# EAGLE design IS31SE5117-Breakout (EAGLE 9.6.2)
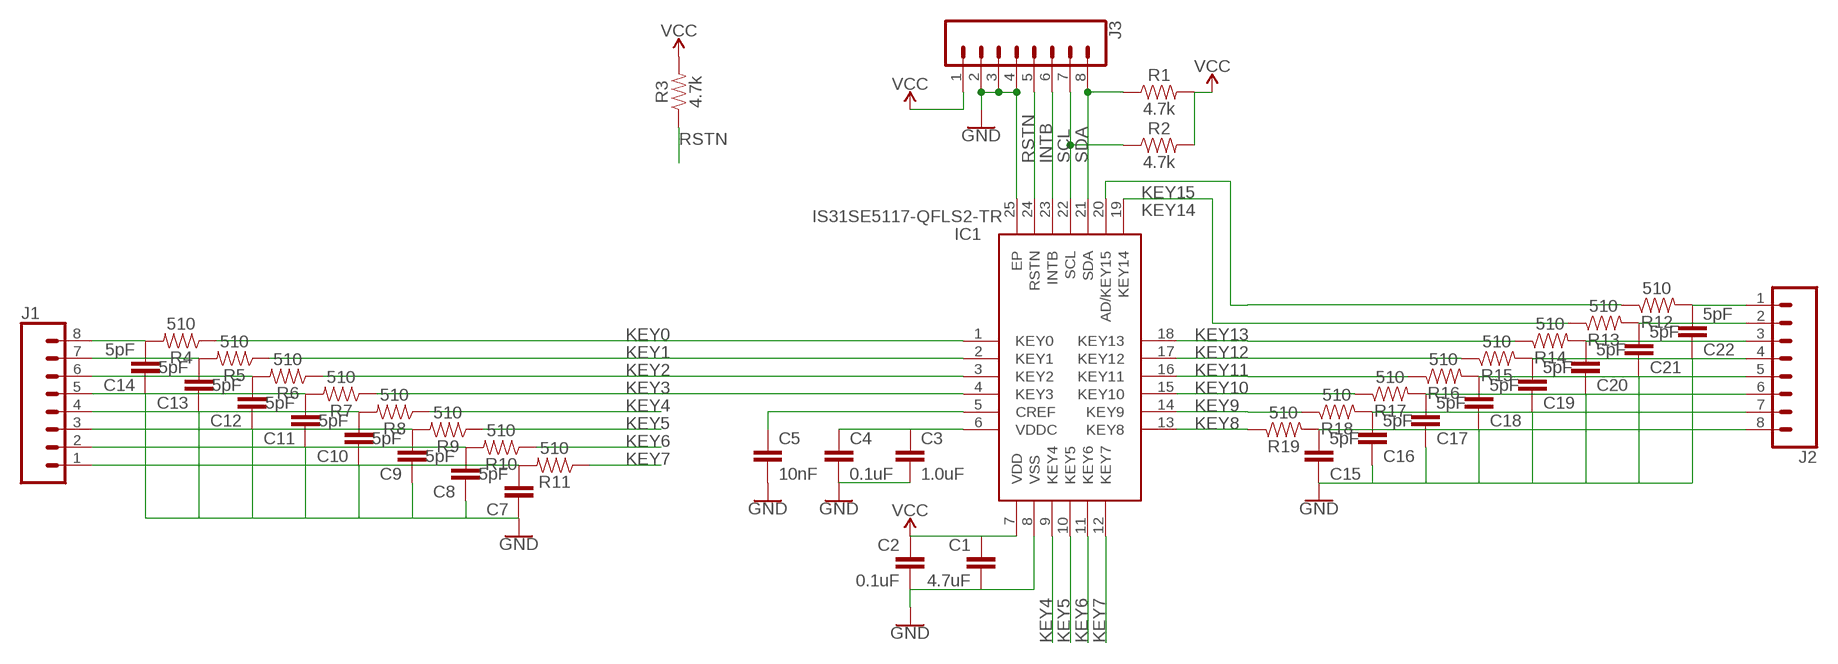
[diagram p0: schematic, sheet 1]

## Parts
C1  4.7uF  1.0UF-0603-16V-10%-X7R  [0603]
C2  0.1uF  0.1UF-0603-25V-10%-X7R-WE  [0603]
C3  1.0uF  1.0UF-0603-16V-10%-X7R  [0603]
C4  0.1uF  0.1UF-0603-25V-10%-X7R-WE  [0603]
C5  10nF  10NF-0603-50V-10%  [0603]
C7  5pF  10NF-0603-50V-10%  [0603]
C8  5pF  10NF-0603-50V-10%  [0603]
C9  5pF  10NF-0603-50V-10%  [0603]
C10  5pF  10NF-0603-50V-10%  [0603]
C11  5pF  10NF-0603-50V-10%  [0603]
C12  5pF  10NF-0603-50V-10%  [0603]
C13  5pF  10NF-0603-50V-10%  [0603]
C14  5pF  10NF-0603-50V-10%  [0603]
C15  5pF  10NF-0603-50V-10%  [0603]
C16  5pF  10NF-0603-50V-10%  [0603]
C17  5pF  10NF-0603-50V-10%  [0603]
C18  5pF  10NF-0603-50V-10%  [0603]
C19  5pF  10NF-0603-50V-10%  [0603]
C20  5pF  10NF-0603-50V-10%  [0603]
C21  5pF  10NF-0603-50V-10%  [0603]
C22  5pF  10NF-0603-50V-10%  [0603]
IC1  IS31SE5117-QFLS2-TR  [QFN50P400X400X65-25N]
J1  CONN_08LONGPADS  [1X08_LONGPADS]
J2  CONN_08LONGPADS  [1X08_LONGPADS]
J3  CONN_08LONGPADS  [1X08_LONGPADS]
R1  4.7k  4.7KOHM-0603-1/10W-1%  [0603]
R2  4.7k  4.7KOHM-0603-1/10W-1%  [0603]
R3  4.7k  4.7KOHM-0603-1/10W-1%  [0603]
R4  510  4.7KOHM-0603-1/10W-1%  [0603]
R5  510  4.7KOHM-0603-1/10W-1%  [0603]
R6  510  4.7KOHM-0603-1/10W-1%  [0603]
R7  510  4.7KOHM-0603-1/10W-1%  [0603]
R8  510  4.7KOHM-0603-1/10W-1%  [0603]
R9  510  4.7KOHM-0603-1/10W-1%  [0603]
R10  510  4.7KOHM-0603-1/10W-1%  [0603]
R11  510  4.7KOHM-0603-1/10W-1%  [0603]
R12  510  4.7KOHM-0603-1/10W-1%  [0603]
R13  510  4.7KOHM-0603-1/10W-1%  [0603]
R14  510  4.7KOHM-0603-1/10W-1%  [0603]
R15  510  4.7KOHM-0603-1/10W-1%  [0603]
R16  510  4.7KOHM-0603-1/10W-1%  [0603]
R17  510  4.7KOHM-0603-1/10W-1%  [0603]
R18  510  4.7KOHM-0603-1/10W-1%  [0603]
R19  510  4.7KOHM-0603-1/10W-1%  [0603]

## Nets
GND: C1.2 C2.2 C3.2 C4.2 C5.2 C7.1 C8.1 C9.1 C10.1 C11.1 C12.1 C13.1 C14.1 C15.1 C16.1 C17.1 C18.1 C19.1 C20.1 C21.1 C22.1 IC1.8(VSS) IC1.25(EP) J3.2 J3.3 J3.4
INTB: IC1.23(INTB) J3.6
KEY0: IC1.1(KEY0) R4.1
KEY1: IC1.2(KEY1) R5.1
KEY2: IC1.3(KEY2) R6.1
KEY3: IC1.4(KEY3) R7.1
KEY4: IC1.9(KEY4) R8.1
KEY5: IC1.10(KEY5) R9.1
KEY6: IC1.11(KEY6) R10.1
KEY7: IC1.12(KEY7) R11.1
KEY8: IC1.13(KEY8) R19.1
KEY9: IC1.14(KEY9) R18.1
KEY10: IC1.15(KEY10) R17.1
KEY11: IC1.16(KEY11) R16.1
KEY12: IC1.17(KEY12) R15.1
KEY13: IC1.18(KEY13) R14.1
KEY14: IC1.19(KEY14) R13.1
KEY15: IC1.20(AD/KEY15) R12.1
N$1: C14.2 J1.8 R4.2
N$2: C13.2 J1.7 R5.2
N$3: C12.2 J1.6 R6.2
N$4: C11.2 J1.5 R7.2
N$5: C10.2 J1.4 R8.2
N$6: C9.2 J1.3 R9.2
N$7: C7.2 J1.1 R11.2
N$8: C8.2 J1.2 R10.2
N$9: C22.2 J2.1 R12.2
N$10: C21.2 J2.2 R13.2
N$11: C20.2 J2.3 R14.2
N$12: C19.2 J2.4 R15.2
N$13: C18.2 J2.5 R16.2
N$14: C3.1 C4.1 IC1.6(VDDC)
N$15: C5.1 IC1.5(CREF)
N$16: C17.2 J2.6 R17.2
N$17: C15.2 J2.8 R19.2
N$18: C16.2 J2.7 R18.2
RSTN: IC1.24(RSTN) J3.5 R3.1
SCL: IC1.22(SCL) J3.7 R2.1
SDA: IC1.21(SDA) J3.8 R1.1
VCC: C1.1 C2.1 IC1.7(VDD) J3.1 R1.2 R2.2 R3.2

## Library data of the parts
C1 = SparkFun-Capacitors:1.0UF: 1µF ceramic capacitors A capacitor is a passive two-terminal electrical component used to store electrical energy temporarily in an electric field.; PROD_ID: CAP-13930; VALUE: 1.0uF
C2 C4 = SparkFun-Capacitors:0.1UF: 0.1µF ceramic capacitors A capacitor is a passive two-terminal electrical component used to store electrical energy temporarily in an electric field.; PROD_ID: CAP-16503
C3 = SparkFun-Capacitors:1.0UF: 1µF ceramic capacitors A capacitor is a passive two-terminal electrical component used to store electrical energy temporarily in an electric field.; PROD_ID: CAP-13930
C5 = SparkFun-Capacitors:10NF: 0.01uF/10nF/10,000pF ceramic capacitors A capacitor is a passive two-terminal electrical component used to store electrical energy temporarily in an electric field. CAP-09321; PROD_ID: CAP-00867
C7-C22 = SparkFun-Capacitors:10NF: 0.01uF/10nF/10,000pF ceramic capacitors A capacitor is a passive two-terminal electrical component used to store electrical energy temporarily in an electric field. CAP-09321; PROD_ID: CAP-00867; VALUE: 10nF
IC1 = SamacSys_Parts:IS31SE5117-QFLS2-TR: Capacitive Touch Sensors MCU with 2KB SRAM and 32Kx16 ECC E-Flash, QFN-24, (4mm x 4mm), T&R Source: Datasheet <https://lumissil.com/assets/pdf/core/IS31SE5117_DS.pdf>; DESCRIPTION: Capacitive Touch Sensors MCU with 2KB SRAM and 32Kx16 ECC E-Flash, QFN-24, (4mm x 4mm), T&R; HEIGHT: 0.65mm; MANUFACTURER_NAME: Lumissil Microsystems; MANUFACTURER_PART_NUMBER: IS31SE5117-QFLS2-TR; MOUSER_PART_NUMBER: 870-IS31SE517QFLS2TR; MOUSER_PRICE-STOCK: https://www.mouser.co.uk/ProductDetail/Lumissil/IS31SE5117-QFLS2-TR/?qs=W%2FMpXkg%252BdQ6cSgyNgg%2FCzg%3D%3D
J1-J3 = SparkFun-Connectors:CONN_08: Multi connection point. Often used as Generic Header-pin footprint for 0.1 inch spaced/style header connections On any of the 0.1 inch spaced packages, you can populate with these: Break Away Headers - Straight <https://www.sparkfun.com/products/116> (PRT-00116) Break Away Male Headers - Right Angle <https://www.sparkfun.com/products/553> (PRT-00553) Female Headers <https://www.sparkfun.com/products/115> (PRT-00115) Break Away Headers - Machine Pin <https://www.sparkfun.com/products/117> (PRT-00117) Break Away Female Headers - Swiss Machine Pin <https://www.sparkfun.com/products/743> (PRT-00743) Arduino Stackable Header - 8 Pin <https://www.sparkfun.com/products/9279> (PRT-09279) For SCREWTERMINALS and SPRING TERMINALS visit here: Screw Terimnals on SparkFun.com <https://www.sparkfun.com/search/results?term=Screw+Terminals> (5mm/3.5mm/2.54mm spacing) This device is also useful as a general connection point to wire up your design to another part of your project. Our various solder wires solder well into these plated through hole pads. Hook-Up Wire - Assortment (Stranded, 22 AWG) <https://www.sparkfun.com/products/11375> (PRT-11375) Hook-Up Wire - Assortment (Solid Core, 22 AWG) <https://www.sparkfun.com/products/11367> (PRT-11367) View the entire wire category on our website here <https://www.sparkfun.com/categories/141> Special notes: Molex polarized connector foot print use with SKU : PRT-08231 with associated crimp pins and housings. 1MM SMD Version SKU: PRT-10208 NOTES ON THE VARIANTS LOCK and LOCK_LONGPADS... This footprint was designed to help hold the alignment of a through-hole component (i.e. 6-pin header) while soldering it into place. You may notice that each hole has been shifted either up or down by 0.005 of an inch from it's more standard position (which is a perfectly straight line). This slight alteration caused the pins (the squares in the middle) to touch the edges of the holes. Because they are alternating, it causes a "brace" to hold the component in place. 0.005 has proven to be the perfect amount of "off-center" position when using our standard breakaway headers. Although looks a little odd when you look at the bare footprint, once you have a header in there, the alteration is very hard to notice. Also,if you push a header all the way into place, it is covered up entirely on the bottom side.
R1-R3 = SparkFun-Resistors:4.7KOHM: 4.7kΩ resistor A resistor is a passive two-terminal electrical component that implements electrical resistance as a circuit element. Resistors act to reduce current flow, and, at the same time, act to lower voltage levels within circuits. - Wikipedia; PROD_ID: RES-07857
R4-R19 = SparkFun-Resistors:4.7KOHM: 4.7kΩ resistor A resistor is a passive two-terminal electrical component that implements electrical resistance as a circuit element. Resistors act to reduce current flow, and, at the same time, act to lower voltage levels within circuits. - Wikipedia; PROD_ID: RES-07857; VALUE: 4.7k

## Board
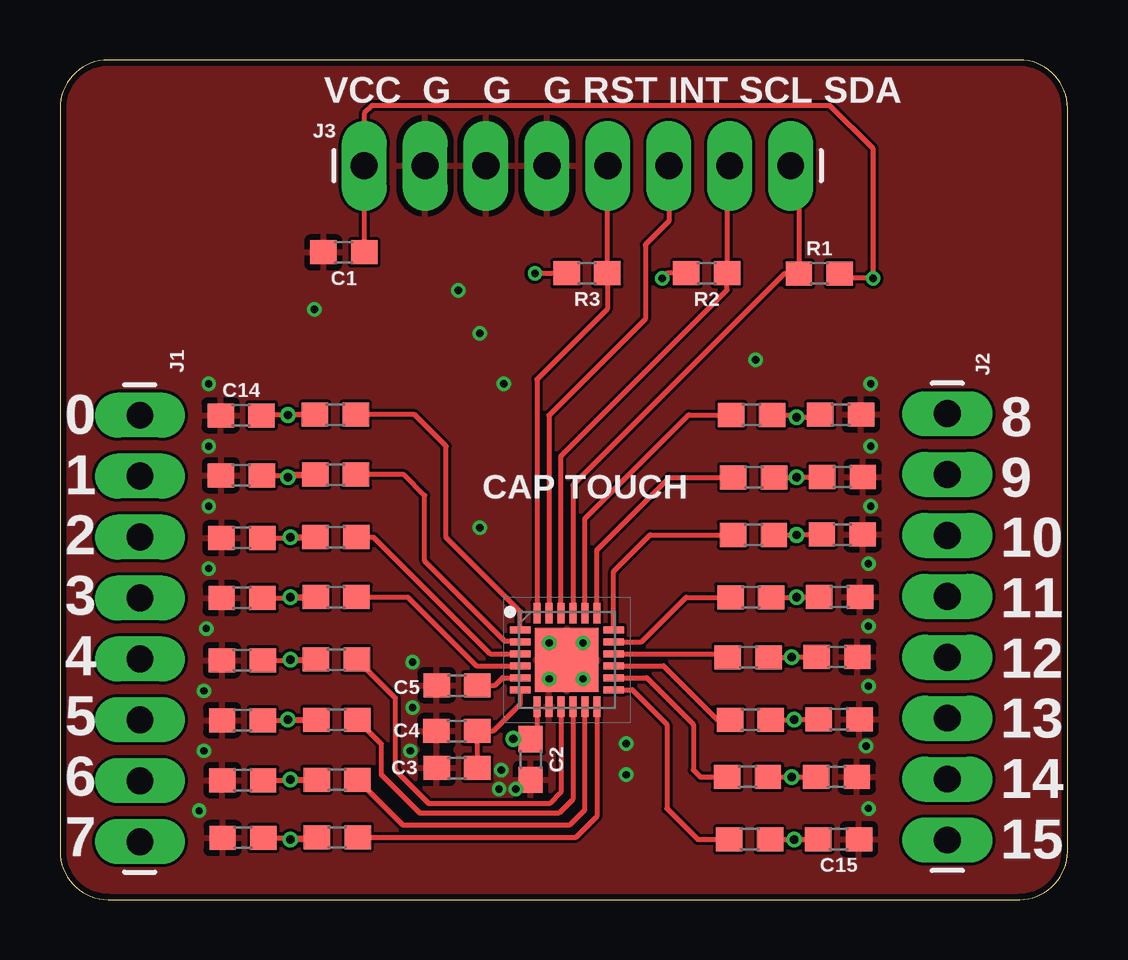
[diagram p1: board, top side]
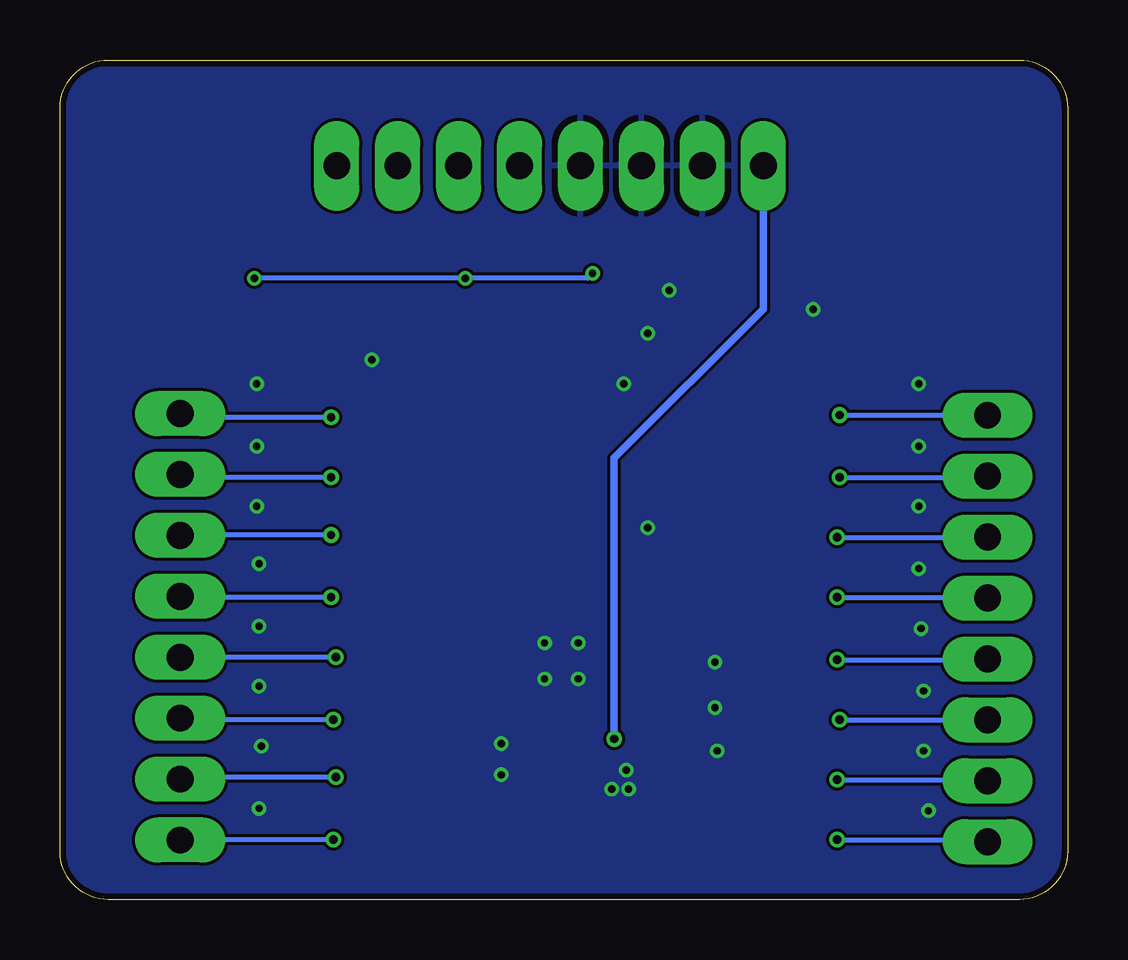
[diagram p2: board, bottom side, seen from below]

Size 42 x 35 mm. Coordinates in mm from the lower left corner, seen from the top.
Outline: 2,0 40,0 arc90 42,2 42,33 arc90 40,35 2,35 arc90 0,33 0,2 arc90 2,0
Copper layers (1*16): Top 0.035mm / dielectric 0.8mm / Bottom 0.035mm
Design rules "jlc-2layer": minimum track width 6mil, minimum drill 0.3mm, track to track 5mil, track to pad 5mil, pad to pad 5mil, via to via 5mil, smd to smd 0mil, copper to edge 0.25mm, drill to drill 10mil, minimum pad ring 10mil, minimum via ring 0.15mm, stop-mask expansion 2mil, vias tented up to drill 100mil, thermal gap 10mil

### Footprints (pad centres in the part's own frame; a part is rotated, then mirrored left to right if it is on the bottom)
0603 = smd 1.1 x 1: 1 -0.85,0; 2 0.85,0
QFN50P400X400X65-25N = smd 0.85 x 0.3: 1 -1.95,1.25; 2 -1.95,0.75; 3 -1.95,0.25; 4 -1.95,-0.25; 5 -1.95,-0.75; 6 -1.95,-1.25; 13 1.95,-1.25; 14 1.95,-0.75; 15 1.95,-0.25; 16 1.95,0.25; 17 1.95,0.75; 18 1.95,1.25 | smd 0.3 x 0.85: 7 -1.25,-1.95; 8 -0.75,-1.95; 9 -0.25,-1.95; 10 0.25,-1.95; 11 0.75,-1.95; 12 1.25,-1.95; 19 1.25,1.95; 20 0.75,1.95; 21 0.25,1.95; 22 -0.25,1.95; 23 -0.75,1.95; 24 -1.25,1.95 | smd 2.65 x 2.65: 25 0,0
1X08_LONGPADS = drill 1.118 pad 1.88 long: 1 0,0; 2 2.54,0; 3 5.08,0; 4 7.62,0; 5 10.16,0; 6 12.7,0; 7 15.24,0; 8 17.78,0

### Placement (x,y rotation side)
C1  11.83,26.98 180 top
C2  19.62,5.84 270 top
C3  16.55,5.48 180 top
C4  16.54,7.03 180 top
C5  16.55,8.93 180 top
C7  7.63,2.57 0 top
C8  7.62,4.97 0 top
C9  7.61,7.47 0 top
C10  7.6,9.97 0 top
C11  7.59,12.57 0 top
C12  7.58,15.07 0 top
C13  7.56,17.68 0 top
C14  7.55,20.18 0 top
C15  32.46,2.52 180 top
C16  32.37,5.12 180 top
C17  32.48,7.52 180 top
C18  32.39,10.12 180 top
C19  32.5,12.62 180 top
C20  32.61,15.22 180 top
C21  32.62,17.62 180 top
C22  32.54,20.21 180 top
IC1  21.13,9.99 0 top
J1  3.33,2.41 90 top
J2  36.99,20.26 270 top
J3  12.68,30.59 0 top
R1  31.65,26.09 0 top
R2  26.96,26.11 180 top
R3  21.97,26.11 180 top
R4  11.48,20.21 180 top
R5  11.49,17.71 180 top
R6  11.5,15.11 180 top
R7  11.51,12.61 180 top
R8  11.52,10.01 180 top
R9  11.54,7.5 180 top
R10  11.55,5 180 top
R11  11.56,2.6 180 top
R12  28.83,20.2 0 top
R13  28.92,17.6 0 top
R14  28.91,15.2 0 top
R15  28.8,12.6 0 top
R16  28.69,10.1 0 top
R17  28.78,7.5 0 top
R18  28.66,5.11 0 top
R19  28.75,2.51 0 top

### Tracks (layer width: path | path; a pad name or v marks a point on that pad's centre or on a via)
GND  (via drill 0.3)
  Top 0.2: IC1.25 21.13,10.03 v21.8,10.7
  other vias: 16.6,25.4 6.2,18.9 6.2,21.5 6.2,16.4 6.2,13.8 6.1,11.3 6,8.7 6,6.2 5.8,3.7 33.7,3.8 33.6,6.4 33.7,8.9 33.7,11.4 33.7,14 33.8,16.4 33.8,18.9 33.8,21.5 14.7,9.9 14.7,8 14.6,6.2 19,4.6 10.6,24.6 18.3,4.6 18.4,5.4 20.4,9.2 21.8,9.2 20.4,10.7 23.6,6.5 17.5,15.5 18.5,21.5 29,22.5 17.5,23.6 23.6,5.2
  pour Top: -3,37 44,37 44,-1 -3,-1
  pour Bottom: -5,38 45,38 45,-2 -5,-2
INTB
  Top 0.2: J3.6 25.38,28.28 24.4,27.3 24.4,24.2 20.38,20.18 IC1.23
KEY0
  Top 0.2: IC1.1 19.18,12.02 16.1,15.1 16.1,18.9 14.79,20.21 R4.1
KEY1
  Top 0.2: IC1.2 19.16,10.76 18.56,10.76 15.2,14.12 15.2,16.85 14.34,17.71 R5.1
KEY2
  Top 0.2: R6.1 13.05,15.11 17.92,10.24 IC1.3
KEY3
  Top 0.2: R7.1 14.49,12.61 17.36,9.74 IC1.4
KEY4
  Top 0.2: IC1.9 20.88,4.48 20.4,4 15.38,4 13.97,5.41 13.97,8.41 R8.1
KEY5
  Top 0.2: IC1.10 21.38,4.18 20.8,3.6 15,3.6 13.39,5.21 13.39,6.5 R9.1
KEY6
  Top 0.2: IC1.11 21.86,8.02 21.86,3.72 21.24,3.1 14.3,3.1 R10.1
KEY7
  Top 0.2: R11.1 21.5,2.6 22.4,3.5 22.4,8.02 IC1.12
KEY8
  Top 0.2: IC1.13 23.86,8.74 25.3,7.3 25.3,3.8 26.59,2.51 R19.1
KEY9
  Top 0.2: IC1.14 24.46,9.24 26.4,7.3 26.4,5.4 26.69,5.11 R18.1
KEY10
  Top 0.2: IC1.15 25.16,9.74 27.4,7.5 R17.1
KEY11
  Top 0.2: IC1.16 27.7,10.24 R16.1
KEY12
  Top 0.2: IC1.17 24.24,10.74 26.1,12.6 R15.1
KEY13
  Top 0.2: IC1.18 23.08,13.68 24.6,15.2 R14.1
KEY14
  Top 0.2: IC1.19 22.38,14.58 25.4,17.6 R13.1
KEY15
  Top 0.2: IC1.20 21.88,15.88 26.2,20.2 R12.1
N$1  (via drill 0.35)
  Top 0.2: R4.2 10.5,20.21 | 10.5,20.21 v9.51,20.21 v9.5,20.2 | C14.2 8.43,20.21 10.5,20.21
  Bottom 0.2: v9.5,20.2 J1.8
N$2  (via drill 0.35)
  Top 0.2: R5.2 10.6,17.71 | 10.6,17.71 9.61,17.71 v9.5,17.6 | C13.2 10.57,17.68 10.6,17.71
  Bottom 0.2: v9.5,17.6 3.38,17.6 J1.7
N$3  (via drill 0.35)
  Top 0.2: R6.2 10.4,15.11 | 10.4,15.11 v9.61,15.11 v9.6,15.1 | C12.2 10.36,15.07 10.4,15.11
  Bottom 0.2: v9.6,15.1 J1.6
N$4  (via drill 0.35)
  Top 0.2: R7.2 10.5,12.61 | 10.5,12.61 v9.61,12.61 v9.6,12.6 | C11.2 10.46,12.57 10.5,12.61
  Bottom 0.2: v9.6,12.6 3.36,12.6 J1.5
N$5  (via drill 0.35)
  Top 0.2: R8.2 10.5,10 | 10.5,10 v9.6,10 | C10.2 10.47,9.97 10.5,10
  Bottom 0.2: v9.6,10 3.36,10 J1.4
N$6  (via drill 0.35)
  Top 0.2: v9.5,7.5 R9.2 10.66,7.47 C9.2
  Bottom 0.2: v9.5,7.5 v9.49,7.49 J1.3
N$7  (via drill 0.35)
  Top 0.2: 10.68,2.57 R11.2 | R11.2 10.61,2.5 v9.6,2.5 | C7.2 10.68,2.57 | 10.68,2.57 R11.2
  Bottom 0.2: v9.6,2.5 3.42,2.5 J1.1
N$8  (via drill 0.35)
  Top 0.2: R10.2 10.6,5 | 10.6,5 v9.6,5 | C8.2 10.57,4.97 10.6,5
  Bottom 0.2: v9.6,5 3.38,5 J1.2
N$9  (via drill 0.35)
  Top 0.2: R12.2 30.6,20.2 v30.7,20.1 31.58,20.1 C22.2
  Bottom 0.2: v30.7,20.1 36.83,20.1 J2.1
N$10  (via drill 0.35)
  Top 0.2: R13.2 v30.7,17.6 31.75,17.6 C21.2
  Bottom 0.2: v30.7,17.6 36.87,17.6 J2.2
N$11  (via drill 0.35)
  Top 0.2: R14.2 v30.7,15.2 31.74,15.2 C20.2
  Bottom 0.2: v30.7,15.2 36.97,15.2 J2.3
N$12  (via drill 0.35)
  Top 0.2: R15.2 v30.7,12.6 31.63,12.6 C19.2
  Bottom 0.2: v30.7,12.6 36.95,12.6 J2.4
N$13  (via drill 0.35)
  Top 0.2: R16.2 v30.5,10.1 31.52,10.1 C18.2
  Bottom 0.2: v30.5,10.1 J2.5
N$14
  Top 0.2: IC1.6 19.18,8.54 19.18,8.14 18.08,7.04 C4.1 C3.1 17.44,5.44
N$15
  Top 0.2: C5.1 18.13,8.93 18.44,9.24 IC1.5
N$16  (via drill 0.35)
  Top 0.2: R17.2 v30.6,7.5 31.61,7.5 C17.2
  Bottom 0.2: v30.6,7.5 36.93,7.5 J2.6
N$17  (via drill 0.35)
  Top 0.2: R19.2 v30.59,2.51 v30.6,2.5 31.59,2.5 C15.2
  Bottom 0.2: v30.6,2.5 36.97,2.5 J2.8
N$18  (via drill 0.35)
  Top 0.2: R18.2 v30.49,5.11 v30.5,5.1 31.5,5.1 C16.2
  Bottom 0.2: v30.5,5.1 36.91,5.1 J2.7
RSTN
  Top 0.2: J3.5 22.82,30.57 R3.1 22.82,24.62 19.88,21.68 IC1.24
SCL
  Top 0.2: J3.7 27.81,30.48 R2.1 27.81,25.41 20.88,18.48 IC1.22
SDA
  Top 0.2: J3.8 30.8,30.25 R1.1 30.19,26.09 21.38,17.28 IC1.21
VCC  (via drill 0.3, 0.35)
  Top 0.2: IC1.7 19.88,6.95 C2.1 | J3.1 12.68,30.5 | 12.68,30.5 C1.1 | R1.2 32.69,25.9 v33.9,25.9 33.9,31.3 32.1,33.1 13,33.1 12.68,32.78 12.68,30.5 | R2.2 25.31,26.11 v25.1,25.9 | R3.2 v19.8,26.1
  Top 0.305: v18.9,6.7 C2.1
  Bottom 0.2: v33.9,25.9 v25.1,25.9 20,25.9 v19.8,26.1
  Bottom 0.305: J3.1 12.68,25.7 12.68,24.62 18.9,18.4 v18.9,6.7

### Text on the board
tPlace: VCC G G G RST INT SCL SDA | CAP TOUCH | 0 / 1 / 2 / 3 / 4 / 5 / 6 / 7 | 8 / 9 / 10 / 11 / 12 / 13 / 14 / 15